# Altium project TGIS Main.PrjPcb
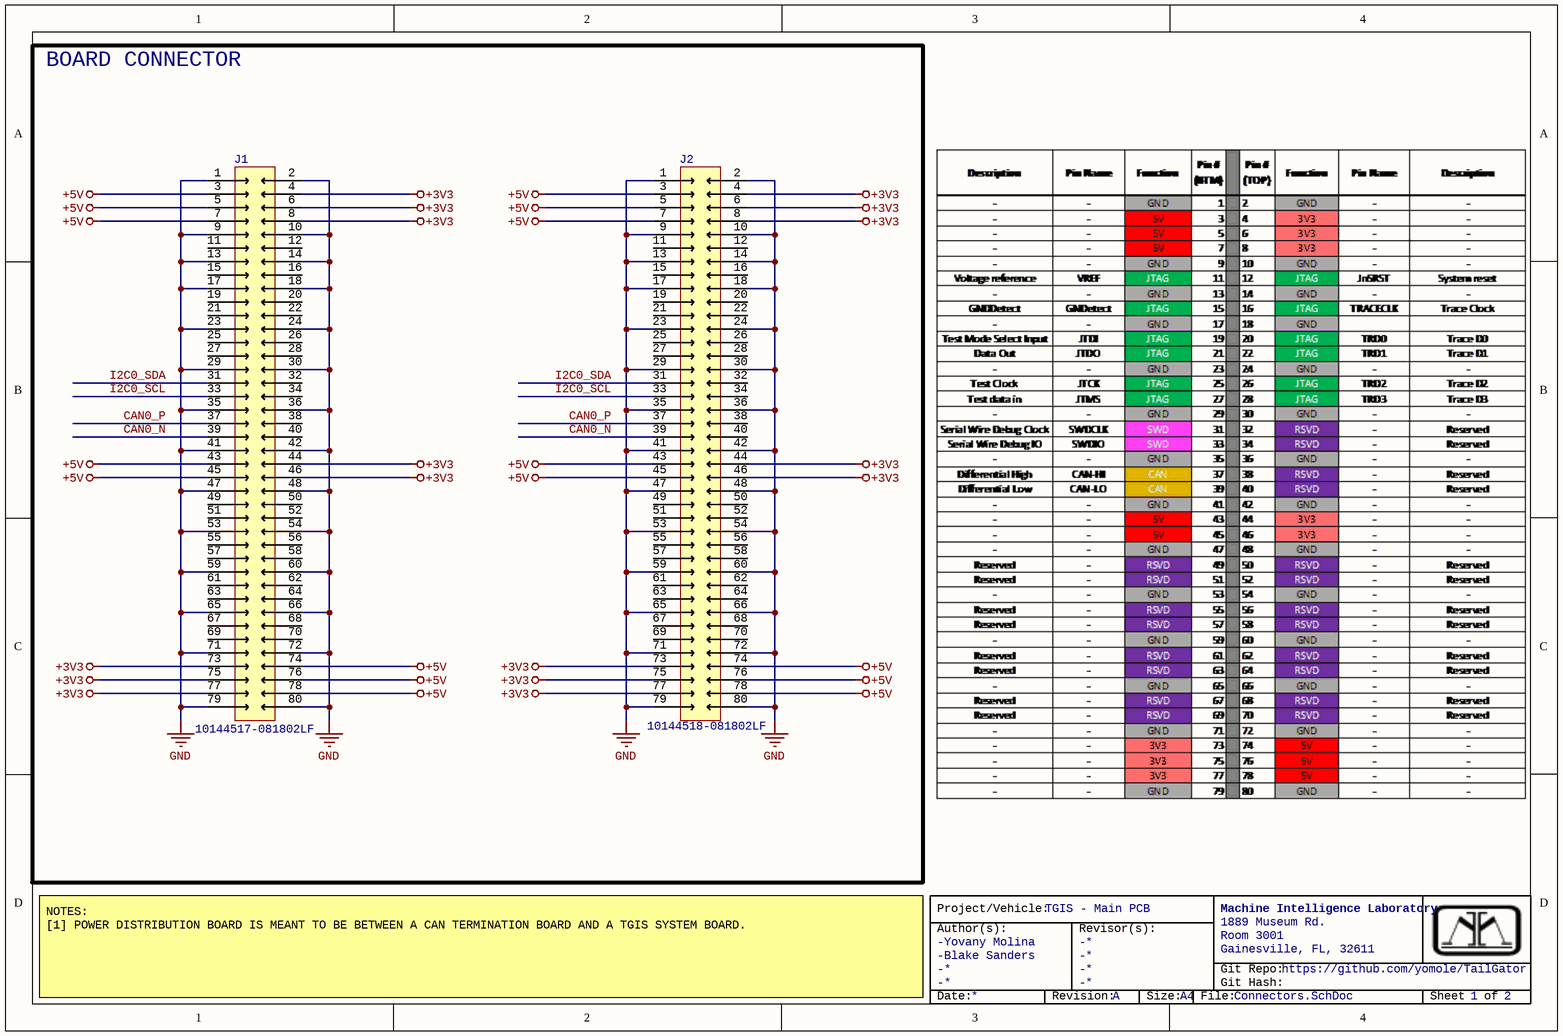
[diagram p0: Connectors.SchDoc]
Author1: Yovany Molina; Author2: Blake Sanders; Project: TGIS - Main PCB; Revision: A; VersionControl_Repository: https://github.com/yomole/TailGator
2 sheets, 34 parts. Net scope: global (net labels, ports and power ports of the same name join across sheets).
Board file: MainPCB.PcbDoc
Sheets:
  Connectors.SchDoc
  Power.SchDoc

## Sheet Connectors.SchDoc
size A4; Organization: Machine Intelligence Laboratory; Address1: 1889 Museum Rd.; Address2: Room 3001; Address3: Gainesville, FL, 32611; Address4: ADDRESS 4; SheetNumber: 1; SheetTotal: 2; ENG_APP_DATE: --/--/--; DSN_APP_DATE: --/--/--; CHK_APP_DATE: --/--/--

### Parts
J1  10144517-081802LF  [AMPHENOL_10144517-081802LF]
J2  10144518-081802LF  [AMPHENOL_10144518-081802LF]

### Blocks framed on the sheet
BOARD CONNECTOR: J1 J2

### Nets
+3V3: J1.4 J1.6 J1.8 J1.44 J1.46 J1.73 J1.75 J1.77 J2.4 J2.6 J2.8 J2.44 J2.46 J2.73 J2.75 J2.77
+5V: J1.3 J1.5 J1.7 J1.43 J1.45 J1.74 J1.76 J1.78 J2.3 J2.5 J2.7 J2.43 J2.45 J2.74 J2.76 J2.78
GND: J1.1 J1.2 J1.9 J1.10 J1.13 J1.14 J1.17 J1.18 J1.23 J1.24 J1.29 J1.30 J1.35 J1.36 J1.41 J1.42 J1.47 J1.48 J1.53 J1.54 J1.59 J1.60 J1.65 J1.66 J1.71 J1.72 J1.79 J1.80 J2.1 J2.2 J2.9 J2.10 J2.13 J2.14 J2.17 J2.18 J2.23 J2.24 J2.29 J2.30 J2.35 J2.36 J2.41 J2.42 J2.47 J2.48 J2.53 J2.54 J2.59 J2.60 J2.65 J2.66 J2.71 J2.72 J2.79 J2.80
CAN0_N: J1.39 J2.39
CAN0_P: J1.37 J2.37
I2C0_SCL: J1.33 J2.33
I2C0_SDA: J1.31 J2.31

Not connected (* = marked no-connect by the designer): J1 11 12 15 16 19 20 21 22 25 26 27 28 32 34 38 40 49 50 51 52 55 56 57 58 61 62 63 64 67 68 69 70; J2 11 12 15 16 19 20 21 22 25 26 27 28 32 34 38 40 49 50 51 52 55 56 57 58 61 62 63 64 67 68 69 70

### Notes on the sheet
- NOTES:
  [1] POWER DISTRIBUTION BOARD IS MEANT TO BE BETWEEN A CAN TERMINATION BOARD AND A TGIS SYSTEM BOARD.
- Project/Vehicle:
- Author(s):
- -
- Revisor(s):
- Git Repo:
- Git Hash:
- Date:
- Revision:
- Size:
- A4
- File:
- Sheet
- of

### Library data of the parts
J1 = 10144517-081802LF: CONN RCPT 1 80POS SMD GOLD; System: Connector; Supplier 1: Digikey; Supplier Part Number 1: 609-5437-1-ND
J2 = 10144518-081802LF: CONN PLUG 1 80POS SMD GOLD; System: Connector; Supplier 1: Digikey; Supplier Part Number 1: 609-5453-1-ND

## Sheet Power.SchDoc
size A; Organization: Machine Intelligence Laboratory; Address1: 1889 Museum Rd; Address2: Room 3001; Address3: Gainesville, FL, 32611; SheetNumber: 2; SheetTotal: 2
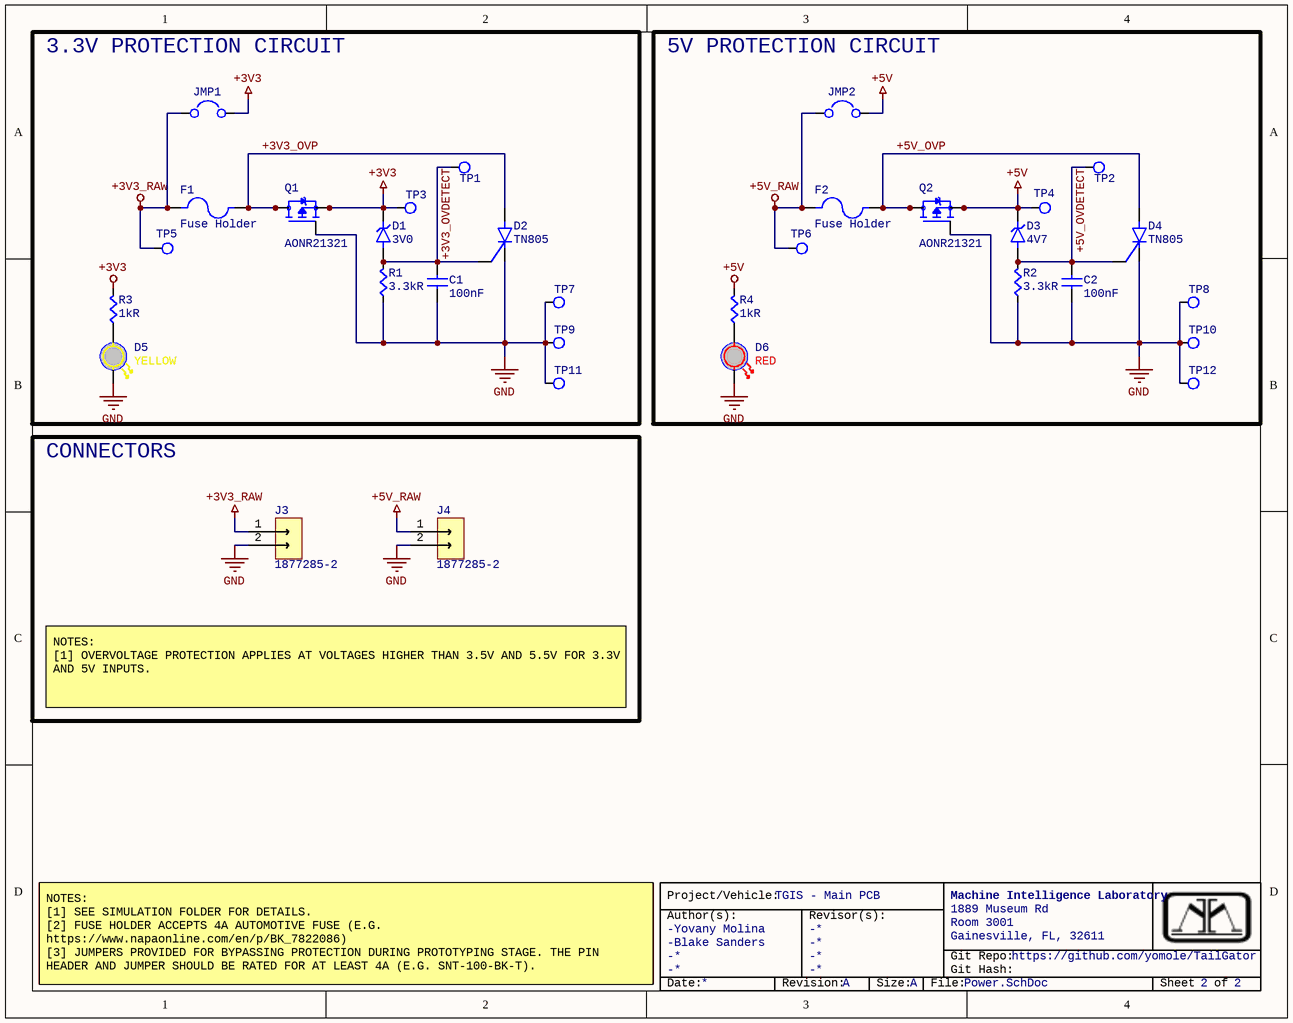
[diagram p1: Power.SchDoc]

### Parts
C1  100nF  [CAPC0603]
C2  100nF  [CAPC0603]
D1  3V0  [SOD3715X135N]
D2  TN805  [DPAK_TN]
D3  4V7  [SOD3715X135N]
D4  TN805  [DPAK_TN]
D5  YELLOW  [LED0603]
D6  RED  [LED0603]
F1  Fuse Holder  [FUSE_3568]
F2  Fuse Holder  [FUSE_3568]
J3  1877285-2  [TE_1877285-2]
J4  1877285-2  [TE_1877285-2]
JMP1  2PINJUMPER  [2PinJumper]  (value not drawn)  (no BOM)
JMP2  2PINJUMPER  [2PinJumper]  (value not drawn)  (no BOM)
Q1  AONR21321  [TRANS_AONR21321]
Q2  AONR21321  [TRANS_AONR21321]
R1  3.3kR  [RES0603]
R2  3.3kR  [RES0603]
R3  1kR  [RES0603]
R4  1kR  [RES0603]
TP1  TP  [TPTH-100mil]  (value not drawn)  (no BOM)
TP2  TP  [TPTH-100mil]  (value not drawn)  (no BOM)
TP3  TP  [TPTH-100mil]  (value not drawn)  (no BOM)
TP4  TP  [TPTH-100mil]  (value not drawn)  (no BOM)
TP5  TP  [TPTH-100mil]  (value not drawn)  (no BOM)
TP6  TP  [TPTH-100mil]  (value not drawn)  (no BOM)
TP7  TP  [TPTH-100mil]  (value not drawn)  (no BOM)
TP8  TP  [TPTH-100mil]  (value not drawn)  (no BOM)
TP9  TP  [TPTH-100mil]  (value not drawn)  (no BOM)
TP10  TP  [TPTH-100mil]  (value not drawn)  (no BOM)
TP11  TP  [TPTH-100mil]  (value not drawn)  (no BOM)
TP12  TP  [TPTH-100mil]  (value not drawn)  (no BOM)

### Blocks framed on the sheet
3.3V PROTECTION CIRCUIT: C1 D1 D2 D5 F1 JMP1 Q1 R1 R3 TP1 TP3 TP5 TP7 TP9 TP11
5V PROTECTION CIRCUIT: C2 D3 D4 D6 F2 JMP2 Q2 R2 R4 TP2 TP4 TP6 TP8 TP10 TP12
CONNECTORS: J3 J4

### Nets
+3V3: D1.K JMP1.2 Q1.1(S) Q1.2(S) Q1.3(S) R3.1(A) TP3.1
+3V3_RAW: F1.1 F1.3 J3.1 JMP1.1 TP5.1
+5V: D3.K JMP2.2 Q2.1(S) Q2.2(S) Q2.3(S) R4.1(A) TP4.1
+5V_RAW: F2.1 F2.3 J4.1 JMP2.1 TP6.1
GND: C1.2(B) C2.2(B) D2.K D4.K D5.C D6.C J3.2 J4.2 Q1.4(G) Q2.4(G) R1.2(B) R2.2(B) TP7.1 TP8.1 TP9.1 TP10.1 TP11.1 TP12.1
+3V3_OVDETECT: C1.1(A) D1.A D2.G R1.1(A) TP1.1
+3V3_OVP: D2.A F1.2 F1.4 Q1.5(D) Q1.6(D) Q1.7(D) Q1.8(D) Q1.9(D) Q1.9_1(D) Q1.9_2(D)
+5V_OVDETECT: C2.1(A) D3.A D4.G R2.1(A) TP2.1
+5V_OVP: D4.A F2.2 F2.4 Q2.5(D) Q2.6(D) Q2.7(D) Q2.8(D) Q2.9(D) Q2.9_1(D) Q2.9_2(D)
NetD5_A: D5.A R3.2(B)
NetD6_A: D6.A R4.2(B)

### Notes on the sheet
- NOTES:
  [1] OVERVOLTAGE PROTECTION APPLIES AT VOLTAGES HIGHER THAN 3.5V AND 5.5V FOR 3.3V AND 5V INPUTS.
- NOTES:
  [1] SEE SIMULATION FOLDER FOR DETAILS.
  [2] FUSE HOLDER ACCEPTS 4A AUTOMOTIVE FUSE (E.G. https://www.napaonline.com/en/p/BK_7822086)
  [3] JUMPERS PROVIDED FOR BYPASSING PROTECTION DURING PROTOTYPING STAGE. THE PIN HEADER AND JUMPER SHOULD BE RATED FOR AT LEAST 4A (E.G. SNT-100-BK-T).
- Project/Vehicle:
- PLACE NOTES BOX HERE
- Author(s):
- -
- Revisor(s):
- Git Repo:
- Git Hash:
- Date:
- Revision:
- Size:
- A
- File:
- Sheet
- of

### Library data of the parts
C1 C2 = CC0603KRX7R7BB104: Ceramic Capacitor, Multilayer, Cera; Manufacturer: Yageo; Multilayer: Yes; Tolerance  (fill in as +-): 10%; Rated DC Voltage (URdc): 16V; Temperature Characteristics Code: X7R; Part Number: CC0603KRX7R7BB104; Category: Ceramic Capacitors; Stock 1: 11347706; Pricing 1: 1=0.1, 10=0.042, 50=0.0238, 100=0.0; Mounting Technology: Surface Mount; Pins: 2; Package Shape: Rectangular; Case/Package: 0603; Terminal Finish: Nickel; Min Operating Temperature: -55°C; Max Operating Temperature: 125°C; JESD-609 Code: e3; Packaging: Tape and Reel; Value: 100nF; Termination: Wraparound; Reach SVHC Compliant: Yes; RoHS Compliant: Yes; ComponentLink1URL: https://datasheet.ciiva.com:443/pdf; ComponentLink1Description: https://datasheet.ciiva.com:443/pdf; ComponentLink2URL: https://datasheet.ciiva.com/11786/0; ComponentLink2Description: https://datasheet.ciiva.com/11786/0; ComponentLink3URL: https://datasheet.ciiva.com/8033/70; ComponentLink3Description: https://datasheet.ciiva.com/8033/70; ComponentLink4URL: https://datasheet.ciiva.com/7978/14; ComponentLink4Description: https://datasheet.ciiva.com/7978/14; ComponentLink5URL: https://datasheet.ciiva.com/28450/1; ComponentLink5Description: https://datasheet.ciiva.com/28450/1; ComponentLink6URL: https://datasheet.ciiva.com/46430/1; ComponentLink6Description: https://datasheet.ciiva.com/46430/1; ComponentLink7URL: https://datasheet.ciiva.com/144/mlc; ComponentLink7Description: https://datasheet.ciiva.com/144/mlc; ComponentLink8URL: https://datasheet.ciiva.com/144/mlc; ComponentLink8Description: https://datasheet.ciiva.com/144/mlc; ComponentLink9URL: https://datasheet.ciiva.com/144/mlc; ComponentLink9Description: https://datasheet.ciiva.com/144/mlc; Supplier Part Number 1: 311-1088-1-ND; Manufacturer Part Number: CC0603KRX7R7BB104; RoHS: Yes; Package Style: SMTMeter; Supplier 1: Digikey; Dielectric Material: Ceramic; Capacitor Type: Ceramic; Tolerance (fill in as +-): 10%; Length: 1.6mm; Width: 0.8mm; Height: 0.8mm; ComponentLink10URL: https://datasheet.ciiva.com/8033/17; ComponentLink10Description: https://datasheet.ciiva.com/8033/17; ComponentLink11URL: https://datasheet.ciiva.com/13395/u; ComponentLink11Description: https://datasheet.ciiva.com/13395/u; ComponentLink12URL: https://datasheet.ciiva.com/11464/u; ComponentLink12Description: https://datasheet.ciiva.com/11464/u; ComponentLink13URL: https://datasheet.ciiva.com/15165/g; ComponentLink13Description: https://datasheet.ciiva.com/15165/g; ComponentLink14URL: https://datasheet.ciiva.com:443/pdfs/VipMasterIC/IC/YAGO/YAGO-S-A0003557223; ComponentLink14Description: https://datasheet.ciiva.com:443/pdfs/VipMasterIC/IC/YAGO/YAGO-S-A0003557223; ComponentLink15URL: https://datasheet.ciiva.com/11786/0900766b80d84f1d-11786077.pdf?src-supplie; ComponentLink15Description: https://datasheet.ciiva.com/11786/0900766b80d84f1d-11786077.pdf?src-supplie; ComponentLink16URL: https://datasheet.ciiva.com/8033/70765-8033799.pdf?src-supplier=Element14; ComponentLink16Description: https://datasheet.ciiva.com/8033/70765-8033799.pdf?src-supplier=Element14; ComponentLink17URL: https://datasheet.ciiva.com/7978/1489800-7978141.pdf?src-supplier=Element14; ComponentLink17Description: https://datasheet.ciiva.com/7978/1489800-7978141.pdf?src-supplier=Element14; ComponentLink18URL: https://datasheet.ciiva.com/28450/1489800-28450552.pdf?src-supplier=Element
D1 = BZT52C3V0: DIODE ZENER 3.0V 500MW SOD123; MP: BZT52C4V7S R9; MF: Taiwan Semiconductor; Availability: In Stock; Package: SOD-323F-2 Taiwan Semiconductor; SnapEDA_Link: https://www.snapeda.com/parts/BZT52C4V7S%20R9/Taiwan+Semiconductor/view-part/?ref=snap; Check_prices: https://www.snapeda.com/parts/BZT52C4V7S%20R9/Taiwan+Semiconductor/view-part/?ref=eda; Value: *; Price: None; Supplier 1: Digikey; Supplier Part Number 1: BZT52C3V0-FDICT-ND
D2 D4 = TN805-600B-TR: SCR 600 V 8 A Standard Recovery Surface Mount DPAK; MP: BZT52C4V7S R9; MF: Taiwan Semiconductor; Availability: In Stock; Package: SOD-323F-2 Taiwan Semiconductor; SnapEDA_Link: https://www.snapeda.com/parts/BZT52C4V7S%20R9/Taiwan+Semiconductor/view-part/?ref=snap; Check_prices: https://www.snapeda.com/parts/BZT52C4V7S%20R9/Taiwan+Semiconductor/view-part/?ref=eda; Value: *; Price: None; Supplier 1: Digikey; Supplier Part Number 1: 497-6769-1-ND
D3 = BZT52C4V7: DIODE ZENER 4.7V 500MW SOD123; MP: BZT52C4V7S R9; MF: Taiwan Semiconductor; Availability: In Stock; Package: SOD-323F-2 Taiwan Semiconductor; SnapEDA_Link: https://www.snapeda.com/parts/BZT52C4V7S%20R9/Taiwan+Semiconductor/view-part/?ref=snap; Check_prices: https://www.snapeda.com/parts/BZT52C4V7S%20R9/Taiwan+Semiconductor/view-part/?ref=eda; Value: *; Price: None; Supplier 1: Digikey; Supplier Part Number 1: BZT52C4V7-13-FDICT-ND
D5 = 150060YS75000: Single Color LED, Yellow, Water Cle; Manufacturer: Wurth Electronics; Shape: Rectangular; Lens Style: WATER CLEAR; Forward Current: 30mA; Luminous Intensity-Nom: 120mcd; Channels: 1; Viewing Angle: 140°; Overall Height: 0.7mm; Part Number: 150060YS75000; Category: LEDs; Stock 1: 50357; Pricing 1: 1=0.15, 50=0.142, 100=0.122, 500=0.; Mounting Technology: Surface Mount; Pins: 2; Min Operating Temperature: -40°C; Max Operating Temperature: 85°C; Packaging: Tape and Reel; Reach SVHC Compliant: Yes; RoHS Compliant: Yes; ComponentLink1URL: https://datasheet.ciiva.com:443/pdf; ComponentLink1Description: https://datasheet.ciiva.com:443/pdf; ComponentLink2URL: https://datasheet.ciiva.com/23843/1; ComponentLink2Description: https://datasheet.ciiva.com/23843/1; ComponentLink3URL: https://datasheet.ciiva.com/29279/7; ComponentLink3Description: https://datasheet.ciiva.com/29279/7; ComponentLink4URL: https://datasheet.ciiva.com/22656/1; ComponentLink4Description: https://datasheet.ciiva.com/22656/1; ComponentLink5URL: https://datasheet.ciiva.com/29563/1; ComponentLink5Description: https://datasheet.ciiva.com/29563/1; ComponentLink6URL: https://datasheet.ciiva.com/29563/1; ComponentLink6Description: https://datasheet.ciiva.com/29563/1; ComponentLink7URL: https://datasheet.ciiva.com/48430/1; ComponentLink7Description: https://datasheet.ciiva.com/48430/1; Supplier Part Number 1: 732-4981-1-ND; Manufacturer Part Number: 150060YS75000; RoHS: Yes; Supplier 1: Digikey; Color: Yellow; Optoelectronic Device Type: SINGLE COLOR LED; Size: 1.1mm; Terminal Pitch: 1.6mm
D6 = 150060RS75000: Single Color LED, Red, Water Clear,; Manufacturer: Wurth Electronics; Shape: Rectangular; Forward Current: 30mA; Luminous Intensity-Nom: 250mcd; Channels: 1; Viewing Angle: 140°; Overall Height: 0.7mm; Part Number: 150060RS75000; Category: LEDs; Stock 1: 139850; Pricing 1: 1=0.15, 50=0.142, 100=0.122, 500=0.; Mounting Technology: Surface Mount; Pins: 2; Min Operating Temperature: -40°C; Max Operating Temperature: 85°C; Packaging: Tape and Reel; Reach SVHC Compliant: Yes; RoHS Compliant: Yes; ComponentLink1URL: https://datasheet.ciiva.com:443/pdf; ComponentLink1Description: https://datasheet.ciiva.com:443/pdf; ComponentLink2URL: https://datasheet.ciiva.com/29563/1; ComponentLink2Description: https://datasheet.ciiva.com/29563/1; ComponentLink3URL: https://datasheet.ciiva.com/29279/7; ComponentLink3Description: https://datasheet.ciiva.com/29279/7; Supplier Part Number 1: 732-4978-1-ND; Manufacturer Part Number: 150060RS75000; RoHS: Yes; Supplier 1: Digikey; Color: Red; Lens Style: WATER CLEAR; Optoelectronic Device Type: SINGLE COLOR LED; Size: 1.1mm; Terminal Pitch: 1.6mm
F1 F2 = 3568: Fuse Holder 30 A 500V 1 Circuit Blade Through Hole; MP: 3568; Package: None; Availability: Unavailable; Price: None; Value: *; Supplier 1: Future Electronics; Supplier Part Number 1: 4264032
JMP1 JMP2 = 2PINJUMPER: 2 Position Jumper
Q1 Q2 = AONR21321: P-Channel 30 V 24A (Tc) 4.1W (Ta), 24W (Tc) Surface Mount 8-DFN-EP (3x3); MF: Alpha &; SnapEDA_Link: https://www.snapeda.com/parts/AONR21321/Alpha+%2526+Omega+Semiconductor+Inc./view-part/?ref=snap; Package: PowerVDFN-8 Alpha &amp; Omega Semiconductor Inc.; Value: *; MP: AONR21321; Check_prices: https://www.snapeda.com/parts/AONR21321/Alpha+%2526+Omega+Semiconductor+Inc./view-part/?ref=eda; Supplier 1: Digikey; Supplier Part Number 1: 785-1797-1-ND
R1 R2 = RC0603FR-073K3L: Fixed Resistor, Metal Glaze/thick F; Manufacturer: Yageo; Power: 100mW; Rated Temperature: 70°C; Tolerance: 1%; Additional Feature: LASER TRIMMABLE; Temperature Coefficient: 100ppm/°C; Working Voltage: 75V; Package Height: 0.45mm; Package Length: 1.6mm; Package Width: 0.8mm; Part Number: RC0603FR-073K3L; Category: Chip SMD Resistors; Stock 1: 932325; Pricing 1: 1=0.1, 10=0.019, 50=0.0112, 100=0.0; Mounting Technology: Surface Mount; Pins: 2; Package Shape: Rectangular; Case/Package: 0603; Terminal Finish: Nickel; Min Operating Temperature: -55°C; Max Operating Temperature: 155°C; JESD-609 Code: e3; Resistor Type: FIXED RESISTOR; Packaging: Tape and Reel; Value: 3.3kR; Termination: Wraparound; Technology: METAL GLAZE/THICK FILM; Reach SVHC Compliant: Yes; RoHS Compliant: Yes; ComponentLink1URL: https://datasheet.ciiva.com:443/pdf; ComponentLink1Description: https://datasheet.ciiva.com:443/pdf; ComponentLink2URL: https://datasheet.ciiva.com/7746/16; ComponentLink2Description: https://datasheet.ciiva.com/7746/16; ComponentLink3URL: https://datasheet.ciiva.com/46440/1; ComponentLink3Description: https://datasheet.ciiva.com/46440/1; ComponentLink4URL: https://datasheet.ciiva.com/2453/py; ComponentLink4Description: https://datasheet.ciiva.com/2453/py; ComponentLink5URL: https://datasheet.ciiva.com/2453/py; ComponentLink5Description: https://datasheet.ciiva.com/2453/py; ComponentLink6URL: https://datasheet.ciiva.com/7746/44; ComponentLink6Description: https://datasheet.ciiva.com/7746/44; ComponentLink7URL: https://datasheet.ciiva.com/7746/44; ComponentLink7Description: https://datasheet.ciiva.com/7746/44; Supplier Part Number 1: 311-3.30KHRCT-ND; Manufacturer Part Number: RC0603FR-073K3L; RoHS: Yes; Construction: Chip; Package Style: SMTMeter; Supplier 1: Digikey
R3 R4 = RC0603FR-071KL: Fixed Resistor, Metal Glaze/thick F; Manufacturer: Yageo; Power: 100mW; Rated Temperature: 70°C; Tolerance: 1%; Additional Feature: LASER TRIMMABLE; Temperature Coefficient: 100ppm/°C; Working Voltage: 75V; Package Height: 0.45mm; Package Length: 1.6mm; Package Width: 0.8mm; Part Number: RC0603FR-071KL; Category: Chip SMD Resistors; Stock 1: 11540000; Pricing 1: 5000=0.0015, 50000=0.0014, 150000=0; Mounting Technology: Surface Mount; Pins: 2; Package Shape: Rectangular; Case/Package: 0603; Terminal Finish: Nickel; Min Operating Temperature: -55°C; Max Operating Temperature: 155°C; JESD-609 Code: e3; Resistor Type: FIXED RESISTOR; Packaging: Tape and Reel; Value: 1kR; Termination: Wraparound; Technology: METAL GLAZE/THICK FILM; Reach SVHC Compliant: Yes; RoHS Compliant: Yes; ComponentLink1URL: https://datasheet.ciiva.com:443/pdf; ComponentLink1Description: https://datasheet.ciiva.com:443/pdf; ComponentLink2URL: https://datasheet.ciiva.com/11808/0; ComponentLink2Description: https://datasheet.ciiva.com/11808/0; ComponentLink3URL: https://datasheet.ciiva.com/7746/16; ComponentLink3Description: https://datasheet.ciiva.com/7746/16; ComponentLink4URL: https://datasheet.ciiva.com/7660/18; ComponentLink4Description: https://datasheet.ciiva.com/7660/18; ComponentLink5URL: https://datasheet.ciiva.com/7983/44; ComponentLink5Description: https://datasheet.ciiva.com/7983/44; ComponentLink6URL: https://datasheet.ciiva.com/7746/17; ComponentLink6Description: https://datasheet.ciiva.com/7746/17; ComponentLink7URL: https://datasheet.ciiva.com/7746/17; ComponentLink7Description: https://datasheet.ciiva.com/7746/17; ComponentLink8URL: https://datasheet.ciiva.com/8896/py; ComponentLink8Description: https://datasheet.ciiva.com/8896/py; ComponentLink9URL: https://datasheet.ciiva.com/15189/g; ComponentLink9Description: https://datasheet.ciiva.com/15189/g; Supplier Part Number 1: 4016291; Manufacturer Part Number: RC0603FR-071KL; RoHS: Yes; Construction: Chip; Package Style: SMTMeter
J3 J4 = 1877285-2: Supplier 1: Digi-Key; Supplier Part Number 1: A99845-ND

## Nets that join several sheets
+3V3: Connectors (16 pins), Power (7 pins)
+5V: Connectors (16 pins), Power (7 pins)
GND: Connectors (56 pins), Power (18 pins)